# Altium project BaseBoard.PrjPcb
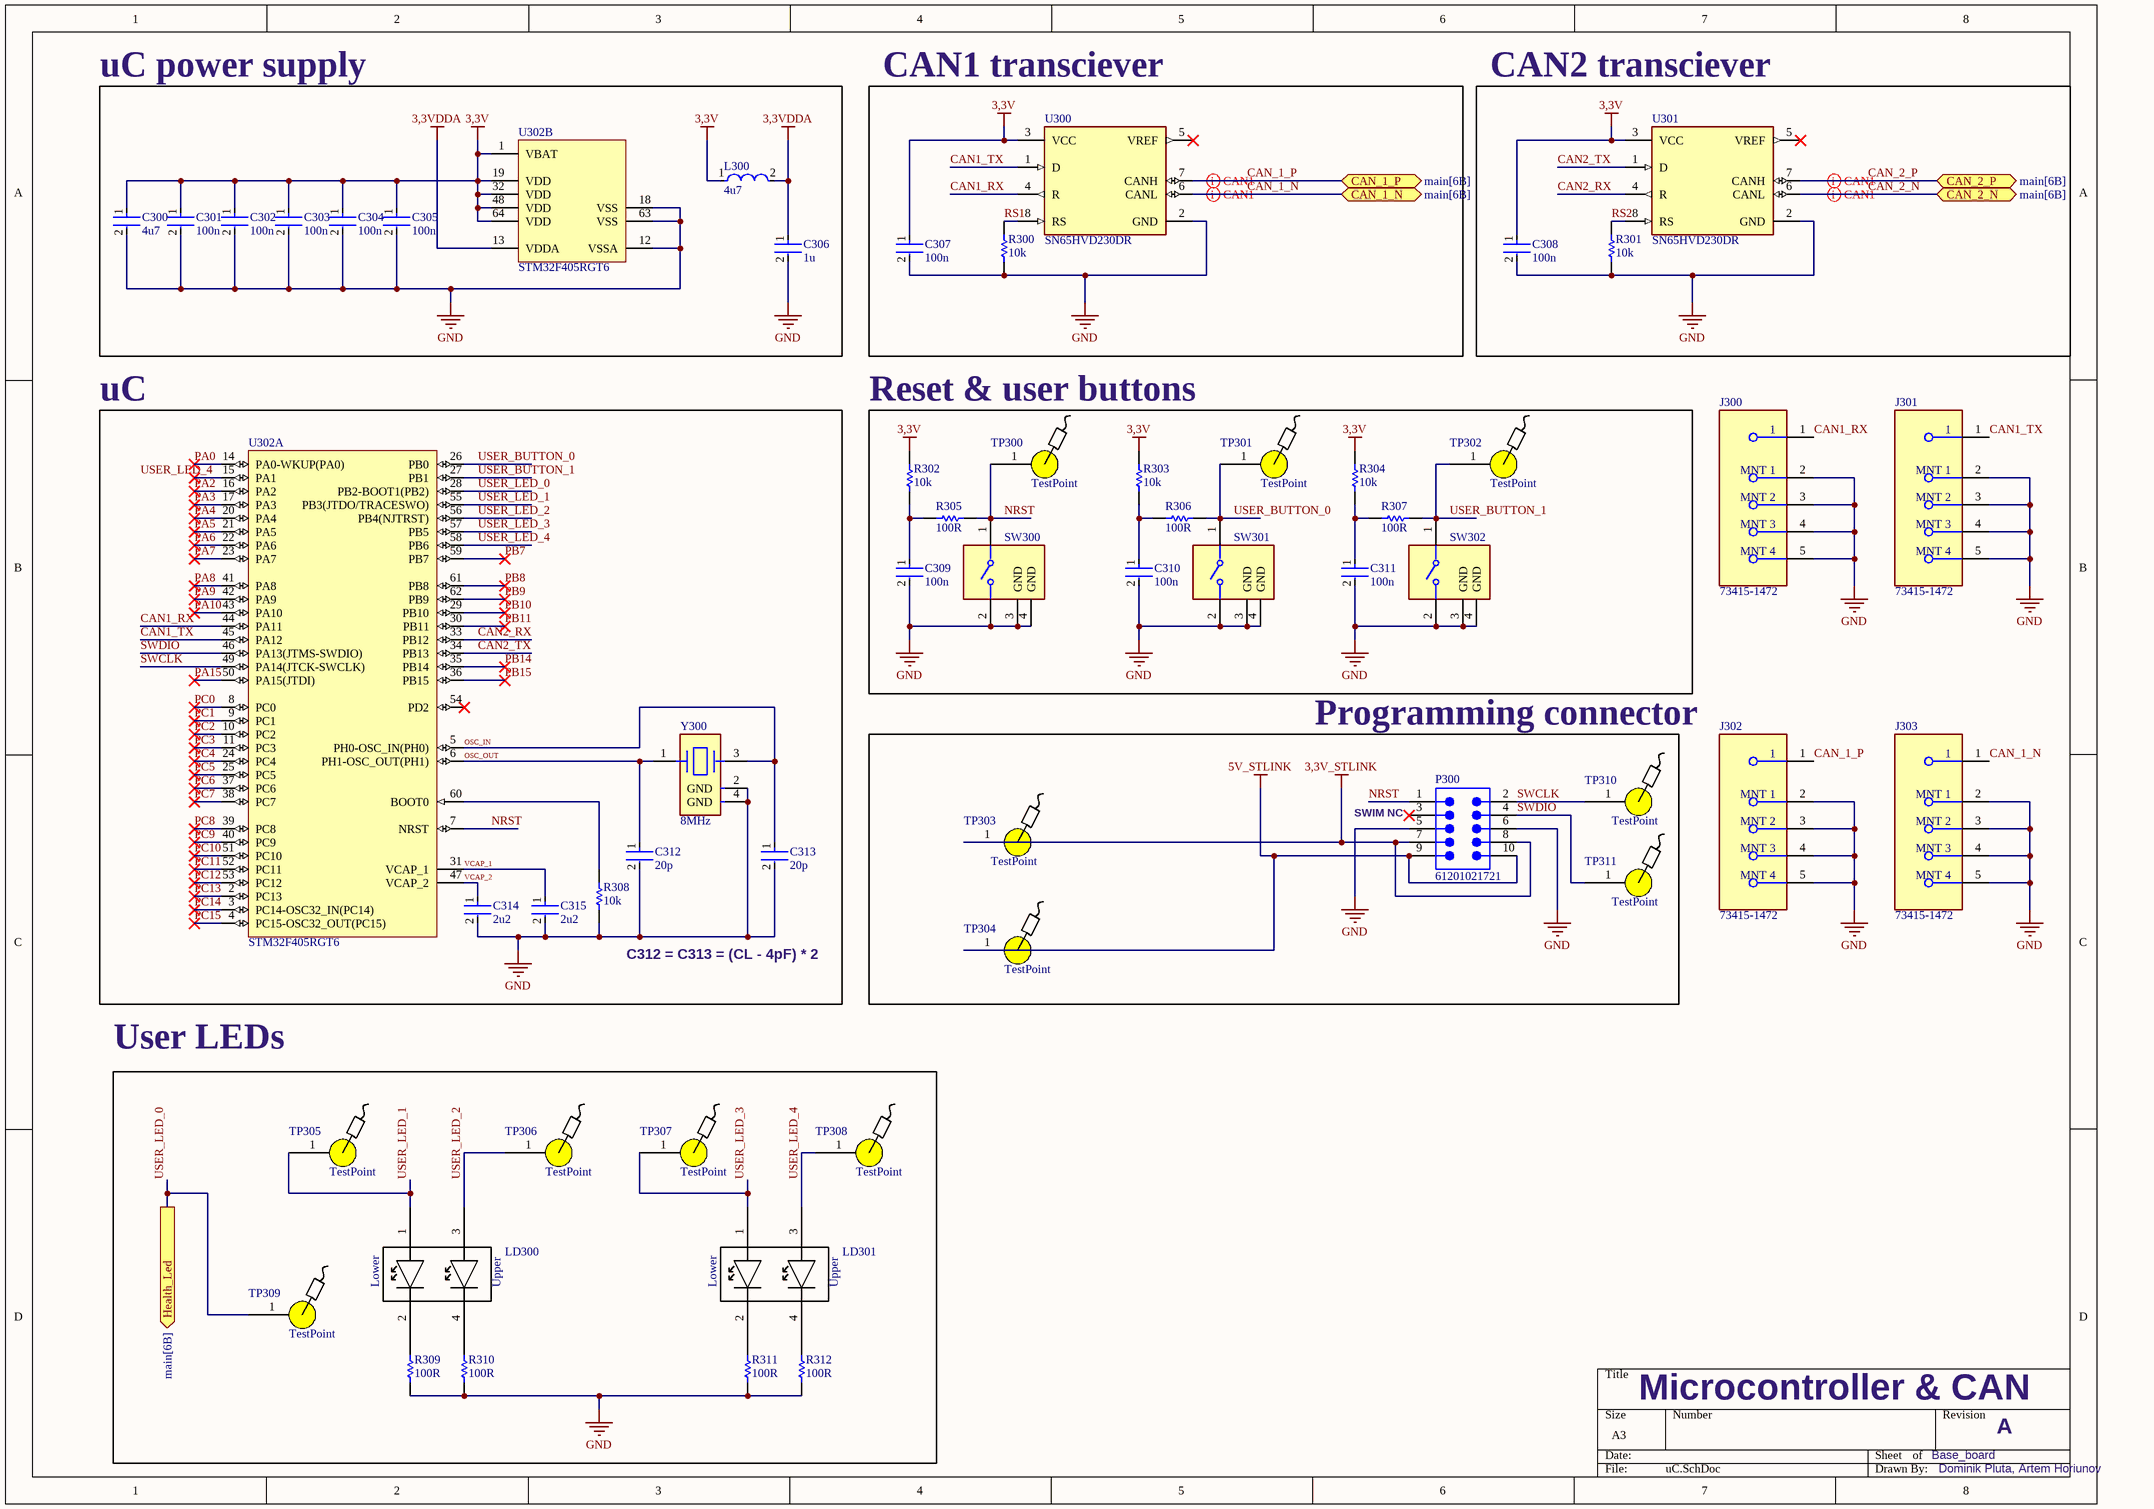
[diagram p0: uC.SchDoc]
2 sheets, 100 parts. Net scope: flat (ports and power ports of the same name join across sheets).
Board files: BaseBoard.PcbDoc, Buck3v3.PcbDoc, Buck5v.PcbDoc
Sheets:
  uC.SchDoc
  power.SchDoc

## Sheet uC.SchDoc
size A3; SheetNumber: 2; SheetTotal: 3

### Parts
C300  4u7  [FP-C0603C-CF-MFG]
C301  100n  [FP-C0603C-CF-MFG]
C302  100n  [FP-C0603C-CF-MFG]
C303  100n  [FP-C0603C-CF-MFG]
C304  100n  [FP-C0603C-CF-MFG]
C305  100n  [FP-C0603C-CF-MFG]
C306  1u  [FP-C0603C-CF-MFG]
C307  100n  [FP-C0603C-CF-MFG]
C308  100n  [FP-C0603C-CF-MFG]
C309  100n  [FP-C0603C-CF-MFG]
C310  100n  [FP-C0603C-CF-MFG]
C311  100n  [FP-C0603C-CF-MFG]
C312  20p  [FP-C0603C-CF-MFG]
C313  20p  [FP-C0603C-CF-MFG]
C314  2u2  [FP-C0603C-CF-MFG]
C315  2u2  [FP-C0603C-CF-MFG]
J300  73415-1472  [FP-73415-1472-MFG]
J301  73415-1472  [FP-73415-1472-MFG]
J302  73415-1472  [FP-73415-1472-MFG]
J303  73415-1472  [FP-73415-1472-MFG]
L300  4u7  [FP-LQM21DN_00-MFG]
LD300  (no value)  [LED_HOLDER]
LD301  (no value)  [LED_HOLDER]
P300  61201021721  [61201021721]
R300  10k  [RESC0603(1608)_N]
R301  10k  [RESC0603(1608)_N]
R302  10k  [RESC0603(1608)_N]
R303  10k  [RESC0603(1608)_N]
R304  10k  [RESC0603(1608)_N]
R305  100R  [RESC0603(1608)_N]
R306  100R  [RESC0603(1608)_N]
R307  100R  [RESC0603(1608)_N]
R308  10k  [RESC0603(1608)_N]
R309  100R  [RESC0603(1608)_N]
R310  100R  [RESC0603(1608)_N]
R311  100R  [RESC0603(1608)_N]
R312  100R  [RESC0603(1608)_N]
SW300  B3F-3122  [FP-B3F-3122-MFG]  (value not drawn)
SW301  B3F-3122  [FP-B3F-3122-MFG]  (value not drawn)
SW302  B3F-3122  [FP-B3F-3122-MFG]  (value not drawn)
TP300  TestPoint  [TestPoint]
TP301  TestPoint  [TestPoint]
TP302  TestPoint  [TestPoint]
TP303  TestPoint  [TestPoint]
TP304  TestPoint  [TestPoint]
TP305  TestPoint  [TestPoint]
TP306  TestPoint  [TestPoint]
TP307  TestPoint  [TestPoint]
TP308  TestPoint  [TestPoint]
TP309  TestPoint  [TestPoint]
TP310  TestPoint  [TestPoint]
TP311  TestPoint  [TestPoint]
U300  SN65HVD230DR  [FP-D0008A-IPC_A]
U301  SN65HVD230DR  [FP-D0008A-IPC_A]
U302  STM32F405RGT6  [STM-LQFP64_M]  (parts A,B of 2)
Y300  8MHz  [FP-7M-MFG]

### Blocks framed on the sheet
uC power supply: C300-C306 L300 U302
CAN1 transciever: C307 R300 U300
CAN2 transciever: C308 R301 U301
uC: C312-C315 R308 U302 Y300
Reset & user buttons: C309-C311 R302-R307 SW300-SW302 TP300-TP302
Programming connector: P300 TP303 TP304 TP310 TP311
User LEDs: LD300 LD301 R309-R312 TP305-TP309

### Ports
CAN_1_N (bidir, see main[6B]), CAN_1_P (bidir, see main[6B]), CAN_2_N (bidir, see main[6B]), CAN_2_P (bidir, see main[6B]), Health_Led (out, see main[6B])

### Nets
3,3V: C300.1 C301.1 C302.1 C303.1 C304.1 C305.1 C307.1 C308.1 L300.1 R302.2 R303.2 R304.2 U300.3(VCC) U301.3(VCC) U302.1(VBAT) U302.19(VDD) U302.32(VDD) U302.48(VDD) U302.64(VDD)
3,3V_STLINK: P300.7 P300.8 TP303.1
3,3VDDA: C306.1 L300.2 U302.13(VDDA)
5V_STLINK: P300.9 P300.10 TP304.1
GND: C300.2 C301.2 C302.2 C303.2 C304.2 C305.2 C306.2 C307.2 C308.2 C309.2 C310.2 C311.2 C312.2 C313.2 C314.2 C315.2 J300.2(MNT_1) J300.3(MNT_2) J300.4(MNT_3) J300.5(MNT_4) J301.2(MNT_1) J301.3(MNT_2) J301.4(MNT_3) J301.5(MNT_4) J302.2(MNT_1) J302.3(MNT_2) J302.4(MNT_3) J302.5(MNT_4) J303.2(MNT_1) J303.3(MNT_2) J303.4(MNT_3) J303.5(MNT_4) P300.5 P300.6 R300.1 R301.1 R308.1 R309.1 R310.1 R311.1 R312.1 SW300.2 SW300.3(GND) SW300.4(GND) SW301.2 SW301.3(GND) SW301.4(GND) SW302.2 SW302.3(GND) SW302.4(GND) U300.2(GND) U301.2(GND) U302.12(VSSA) U302.18(VSS) U302.63(VSS) Y300.2(GND) Y300.4(GND)
CAN1_RX: J300.1 U300.4(R) U302.44(PA11)
CAN1_TX: J301.1 U300.1(D) U302.45(PA12)
CAN2_RX: U301.4(R) U302.33(PB12)
CAN2_TX: U301.1(D) U302.34(PB13)
CAN_1_N: J303.1 U300.6(CANL) ; port CAN_1_N
CAN_1_P: J302.1 U300.7(CANH) ; port CAN_1_P
CAN_2_N: U301.6(CANL) ; port CAN_2_N
CAN_2_P: U301.7(CANH) ; port CAN_2_P
NRST: P300.1 R305.1 SW300.1 TP300.1 U302.7(NRST)
OSC_IN: C313.1 U302.5(PH0-OSC_IN(PH0)) Y300.3
OSC_OUT: C312.1 U302.6(PH1-OSC_OUT(PH1)) Y300.1
PA0: U302.14(PA0-WKUP(PA0))
PA2: U302.16(PA2)
PA3: U302.17(PA3)
PA4: U302.20(PA4)
PA5: U302.21(PA5)
PA6: U302.22(PA6)
PA7: U302.23(PA7)
PA8: U302.41(PA8)
PA9: U302.42(PA9)
PA10: U302.43(PA10)
PA15: U302.50(PA15(JTDI))
PB7: U302.59(PB7)
PB8: U302.61(PB8)
PB9: U302.62(PB9)
PB10: U302.29(PB10)
PB11: U302.30(PB11)
PB14: U302.35(PB14)
PB15: U302.36(PB15)
PC0: U302.8(PC0)
PC1: U302.9(PC1)
PC2: U302.10(PC2)
PC3: U302.11(PC3)
PC4: U302.24(PC4)
PC5: U302.25(PC5)
PC6: U302.37(PC6)
PC7: U302.38(PC7)
PC8: U302.39(PC8)
PC9: U302.40(PC9)
PC10: U302.51(PC10)
PC11: U302.52(PC11)
PC12: U302.53(PC12)
PC13: U302.2(PC13)
PC14: U302.3(PC14-OSC32_IN(PC14))
PC15: U302.4(PC15-OSC32_OUT(PC15))
RS1: R300.2 U300.8(RS)
RS2: R301.2 U301.8(RS)
SWCLK: P300.2 TP310.1 U302.49(PA14(JTCK-SWCLK))
SWDIO: P300.4 TP311.1 U302.46(PA13(JTMS-SWDIO))
USER_BUTTON_0: R306.1 SW301.1 TP301.1 U302.26(PB0)
USER_BUTTON_1: R307.1 SW302.1 TP302.1 U302.27(PB1)
USER_LED_0: TP309.1 U302.28(PB2-BOOT1(PB2)) ; port Health_Led
USER_LED_1: LD300.1 TP305.1 U302.55(PB3(JTDO/TRACESWO))
USER_LED_2: LD300.3 TP306.1 U302.56(PB4(NJTRST))
USER_LED_3: LD301.1 TP307.1 U302.57(PB5)
USER_LED_4: LD301.3 TP308.1 U302.58(PB6)
VCAP_1: C315.1 U302.31(VCAP_1)
VCAP_2: C314.1 U302.47(VCAP_2)
NetC309_1: C309.1 R302.1 R305.2
NetC310_1: C310.1 R303.1 R306.2
NetC311_1: C311.1 R304.1 R307.2
NetLD300_2: LD300.2 R309.2
NetLD300_4: LD300.4 R310.2
NetLD301_2: LD301.2 R311.2
NetLD301_4: LD301.4 R312.2
NetR308_2: R308.2 U302.60(BOOT0)

Not connected (* = marked no-connect by the designer): P300 3*; U300 5(VREF)*; U301 5(VREF)*; U302 15(PA1)* 54(PD2)*

### Layout directives
differential pair: CAN_1_N, CAN_1_P, CAN_2_N, CAN_2_P

### Notes on the sheet
- (near P300) SWIM NC
- (near R308) C312 = C313 = (CL - 4pF) * 2
- Microcontroller & CAN
- Base_board
- A
- Dominik Pluta, Artem Horiunov
- Labels drawn without touching a wire or pin: USER_LED_4
- (in symbol DoubleStack_Side_Led_3mm) Lower; Upper

### Library data of the parts
C300-C311 = CMP-2006-03061-2: CAP CER 0.1UF 50V X7R 0603; Manufacturer: KEMET; Manufacturer Part Number: C0603C104K5RACTU; Tolerance: 0.1; Temperature Coefficient: 30ppm/°C; Material: Ceramic; Automotive Grade: Grade 1; Value: 0.10 μF; Temperature: -55°C to +125°C; RoHS: TRUE; Temperature Range High: +125°C; Lead Free: Yes; Octopart: https://octopart.com/c0603c104k5ractu-kemet-139244; Digikey Description: CAP CER 0.1UF 50V X7R 0603; Category: Cap; Package: C0603C-CF; ComponentLink2Description: Datasheet; Temperature Range Low: -55°C; Device Class L1: Passive Components; Voltage Rating: 50 V; Automotive: Yes; Device Class L3: Ceramic Capacitors; ComponentLink2URL: https://api.kemet.com/component-edge/download/datasheet/C0603C100J5GACAUTO.pdf; Capacitance: 0.10 μF; Device Class L2: Capacitors; Temperature Characteristic: X7R; Height: 0.87mm
C312-C315 = CMP-2006-03061-2: CAP CER 50V X7R 0603; Manufacturer: KEMET; Manufacturer Part Number: C0603C104K5RACTU; Tolerance: 0.1; Temperature Coefficient: 30ppm/°C; Material: Ceramic; Automotive Grade: Grade 1; Value: 0.10 μF; Temperature: -55°C to +125°C; RoHS: TRUE; Temperature Range High: +125°C; Lead Free: Yes; Octopart: https://octopart.com/c0603c104k5ractu-kemet-139244; Digikey Description: CAP CER 0.1UF 50V X7R 0603; Category: Cap; Package: C0603C-CF; ComponentLink2Description: Datasheet; Temperature Range Low: -55°C; Device Class L1: Passive Components; Voltage Rating: 50 V; Automotive: Yes; Device Class L3: Ceramic Capacitors; ComponentLink2URL: https://api.kemet.com/component-edge/download/datasheet/C0603C100J5GACAUTO.pdf; Capacitance: 0.10 μF; Device Class L2: Capacitors; Temperature Characteristic: X7R; Height: 0.87mm
J300-J303 = CMP-00257-24916978-1: 73415-1472 50 Ohms, MMCX Vertical Jack, PCB, Brass and Gold Per Commercial Requirements, One Piece Per Bag; Manufacturer Lifecycle Status: ACTIVE; Dielectric Material: Teflon; Number of Contacts: 1; Resistance: 50Ω; Voltage Rating: 170V; Frequency: 6GHz; Orientation: Straight; Min Operating Temperature: -55°C; Height: 4.55mm; Max Operating Temperature: 165°C; Country of Origin: TW; Lifecycle Status: Production; Packaging: Bulk; Halogen Free: Low Halogen; NexarPartId: 24916978; RoHS: Non-Compliant; Contact Material: Gold; Impedance: 50Ω; Mount: Through Hole
L300 = CMP-06042-016438-1: Multilayer Type Inductor for General Circuits, 0805 (2012), 0.22μH, 10%, 0.38Ω, 250mA; Shielding: Shielded; Self Resonant Frequency: 220MHz; Q Factor: 20; DC Resistance (DCR): 380mR; Inductance: 220nH; Core Material: Ferrite; Test Frequency: 25MHz; Min Operating Temperature: -40°C; RoHS Compliant: Yes; Inductance Tolerance: 10%; Width: 1.25mm; Current Rating: 250mA; Rated Current-Max: 250mA; Package Quantity: 4000; Lead Free: Lead Free; Termination: SMD/SMT; Military Standard: Not; Case Code (Metric): 2012; Radiation Hardening: No; Max Operating Temperature: 85°C; Max DC Current: 250mA; Mount: Surface Mount; Length: 2mm; Packaging: Tape and Reel; Height - Seated (Max): 0.041inch; Series: LQM21N; Case Code (Imperial): 0805; Case/Package: 0805; REACH SVHC: No SVHC; Depth: 1.45mm; Tolerance: 10%; DC Current: 250mA; Number of Pins: 2; Height: 0.85mm
LD300 LD301 = DoubleStack_Side_Led_3mm
P300 = CMP-1502-00021-2: NexarPartId: 8917787; Operating Supply Voltage: 250V; Number of Positions: 10; Contact Resistance: 20mΩ; Connector Type: Male Pin; Current Rating: 3A; Pitch: 2.54mm; Gender: Male; Insulation Resistance: 1GΩ; Insulation: Insulated; Max Operating Temperature: 105°C; Flammability Rating: UL94 V-0; Mount: Through Hole; Contact Material: Copper; Min Operating Temperature: -40°C; Length: 20.36mm; Number of Contacts: 10; Height: 8.85mm; Number of Rows: 2; Housing Material: PBT; Color: Black; Contact Gender: Male; Orientation: Right Angle; Contact Plating: Gold; Number of Pins: 10; Voltage Rating (DC): 250V; RoHS: Compliant; Insulation Material: PBT; REACH SVHC: Unknown; Row Spacing: 2.54mm; Voltage Rating: 250V; Width: 20.36mm; Lead Pitch: 2.54mm; Termination: Through Hole
R300 R301 R308 = CMP-1012-00081-1: 2K 0.1W 5% 0603 (1608 Metric)  SMD; Case-Metric: 1608; Value: 2000.00 Ohm; Case-EIA: 0603; Tolerance: 5 %; Technology: SMT; Power: 0.1 W
R302-R307 = CMP-1012-00081-1: 0.1W 5% 0603 (1608 Metric)  SMD; Case-Metric: 1608; Value: 2000.00 Ohm; Case-EIA: 0603; Tolerance: 5 %; Technology: SMT; Power: 0.1 W
R309-R312 = CMP-1012-00081-1: 0.1W 1% 0603 (1608 Metric)  SMD; Tolerance: 5 %; Case-Metric: 1608; Value: 2000.00 Ohm; Case-EIA: 0603; Technology: SMT; Power: 0.1 W
SW300-SW302 = CMP-08834-000053-1: SWITCH TACTILE SPST-NO 0.05A 24V; Max Current Rating: 50mA; Actuator Type: Standard; Ratings: IP00; Number of Poles: 1; Mechanical Life: 300000Cycles; Illumination Type: Non-Illuminated; Switch Function: Off-Mom; Actuator Color: Grey; Contact Resistance: 100mR; Throw Configuration: SPST; Actuator Length: 1.6mm; Switch Travel: 0.25mm; Operating Force: 1.47N; Weight: 0.25g; Voltage Rating (DC): 24V; Contact Plating: Gold; RoHS Compliant: Yes; Contact Material: Gold; Radiation Hardening: No; Packaging: Bulk; Height: 7.4mm; Min Operating Temperature: -25°C; Electrical Life: 300000Cycles; Depth: 7.85mm; Max Voltage Rating (DC): 24V; Mount: Through Hole; Width: 6.25mm; Current Rating: 50mA; Lead Free: Lead Free; Max Operating Temperature: 70°C; Series: B3F; Contact Current Rating: 50mA; Package Quantity: 1000; Termination: PC Pins; Orientation: Right Angle; Length: 7.3mm
U300 U301 = CMP-0315-00015-3: IC TRANSCEIVER HALF 1/1 8SOIC; Number of Transceivers: 1; Operating Supply Voltage: 3.3V; Number of I/Os: 2; Max Supply Current: 17mA; Max Supply Voltage: 3.6V; Min Supply Voltage: 3V; Data Rate: 1Mbps; Min Operating Temperature: -40°C; Packaging: Tape and Reel; Lead Free: Lead Free; Number of Transmit Buffers: 1; Max Operating Temperature: 85°C; Number of Receive Buffers: 1; Number of Pins: 8; Package Quantity: 1; Radiation Hardening: No; Case/Package: D; REACH SVHC: No SVHC; Weight: 0.002561oz; Termination: SMD/SMT; Contact Plating: Gold; Nominal Supply Current: 17mA; Number of Receivers: 1; Number of Drivers: 1
U302 = CMP-0243-00019-3: ARM Cortex-M4 32-bit MCU+FPU, 210 DMIPS, 1024 kB Flash, 192 kB Internal RAM, 51 I/Os, 64-pin LQFP, -40 to 85 degC, Tray; Manufacturer: STMicroelectronics; Supply Voltage(Vcc) min (V): 1.8; Supply Voltage(Vcc) max (V): 3.6; Internal RAM Size (kB): 192; I/Os (High Current): 51; D/A Converter: 2x12-bit; FLASH Size (Prog) (kB): 1024; Operating Frequency(F) (Processor speed) (MHz): 168; ComponentLink2Description: Datasheet; PackageVersion: Rev. 4, 06/2013; DatasheetVersion: Rev. 4; Core: ARM Cortex-M4; ComponentLink2URL: http://www.st.com/st-web-ui/static/active/en/resource/technical/document/datasheet/DM00037051.pdf; PackageReference: LQFP64; Packing: Tray; ComponentLink1Description: Manufacturer URL; ComponentLink3URL: http://www.st.com/st-web-ui/static/active/en/resource/technical/document/datasheet/DM00037051.pdf; ComponentLink3Description: Package Specification; Mounting Technology: Surface Mount; ComponentLink1URL: http://www.st.com/web/en/home.html; PackageDescription: 64-Pin Low Profile Quad Flat Package, 10 x 10 mm Body, 0.5 mm Pitch; PartNumber: STM32F405RGT6
Y300 = CMP-18717-000311-1: Crystal; ESR (Equivalent Series Resistance): 100R; Frequency: 12MHz; Frequency Stability: 10ppm; Load Capacitance: 10pF; Width: 0.098inch; Number of Pins: 4; Case/Package: SMD/SMT; REACH SVHC: No SVHC; Mount: Surface Mount; Max Operating Temperature: 70°C; RoHS Compliant: Yes; Depth: 2.5mm; Length: 3.2mm; Termination: SMD/SMT; Frequency Tolerance: 10ppm; Min Operating Temperature: -20°C; Series: 7M; Packaging: Tape and Reel; Tolerance: 10ppm; Height: 0.031inch; Package Quantity: 3000

## Sheet power.SchDoc
size A3; SheetNumber: 3; SheetTotal: 3
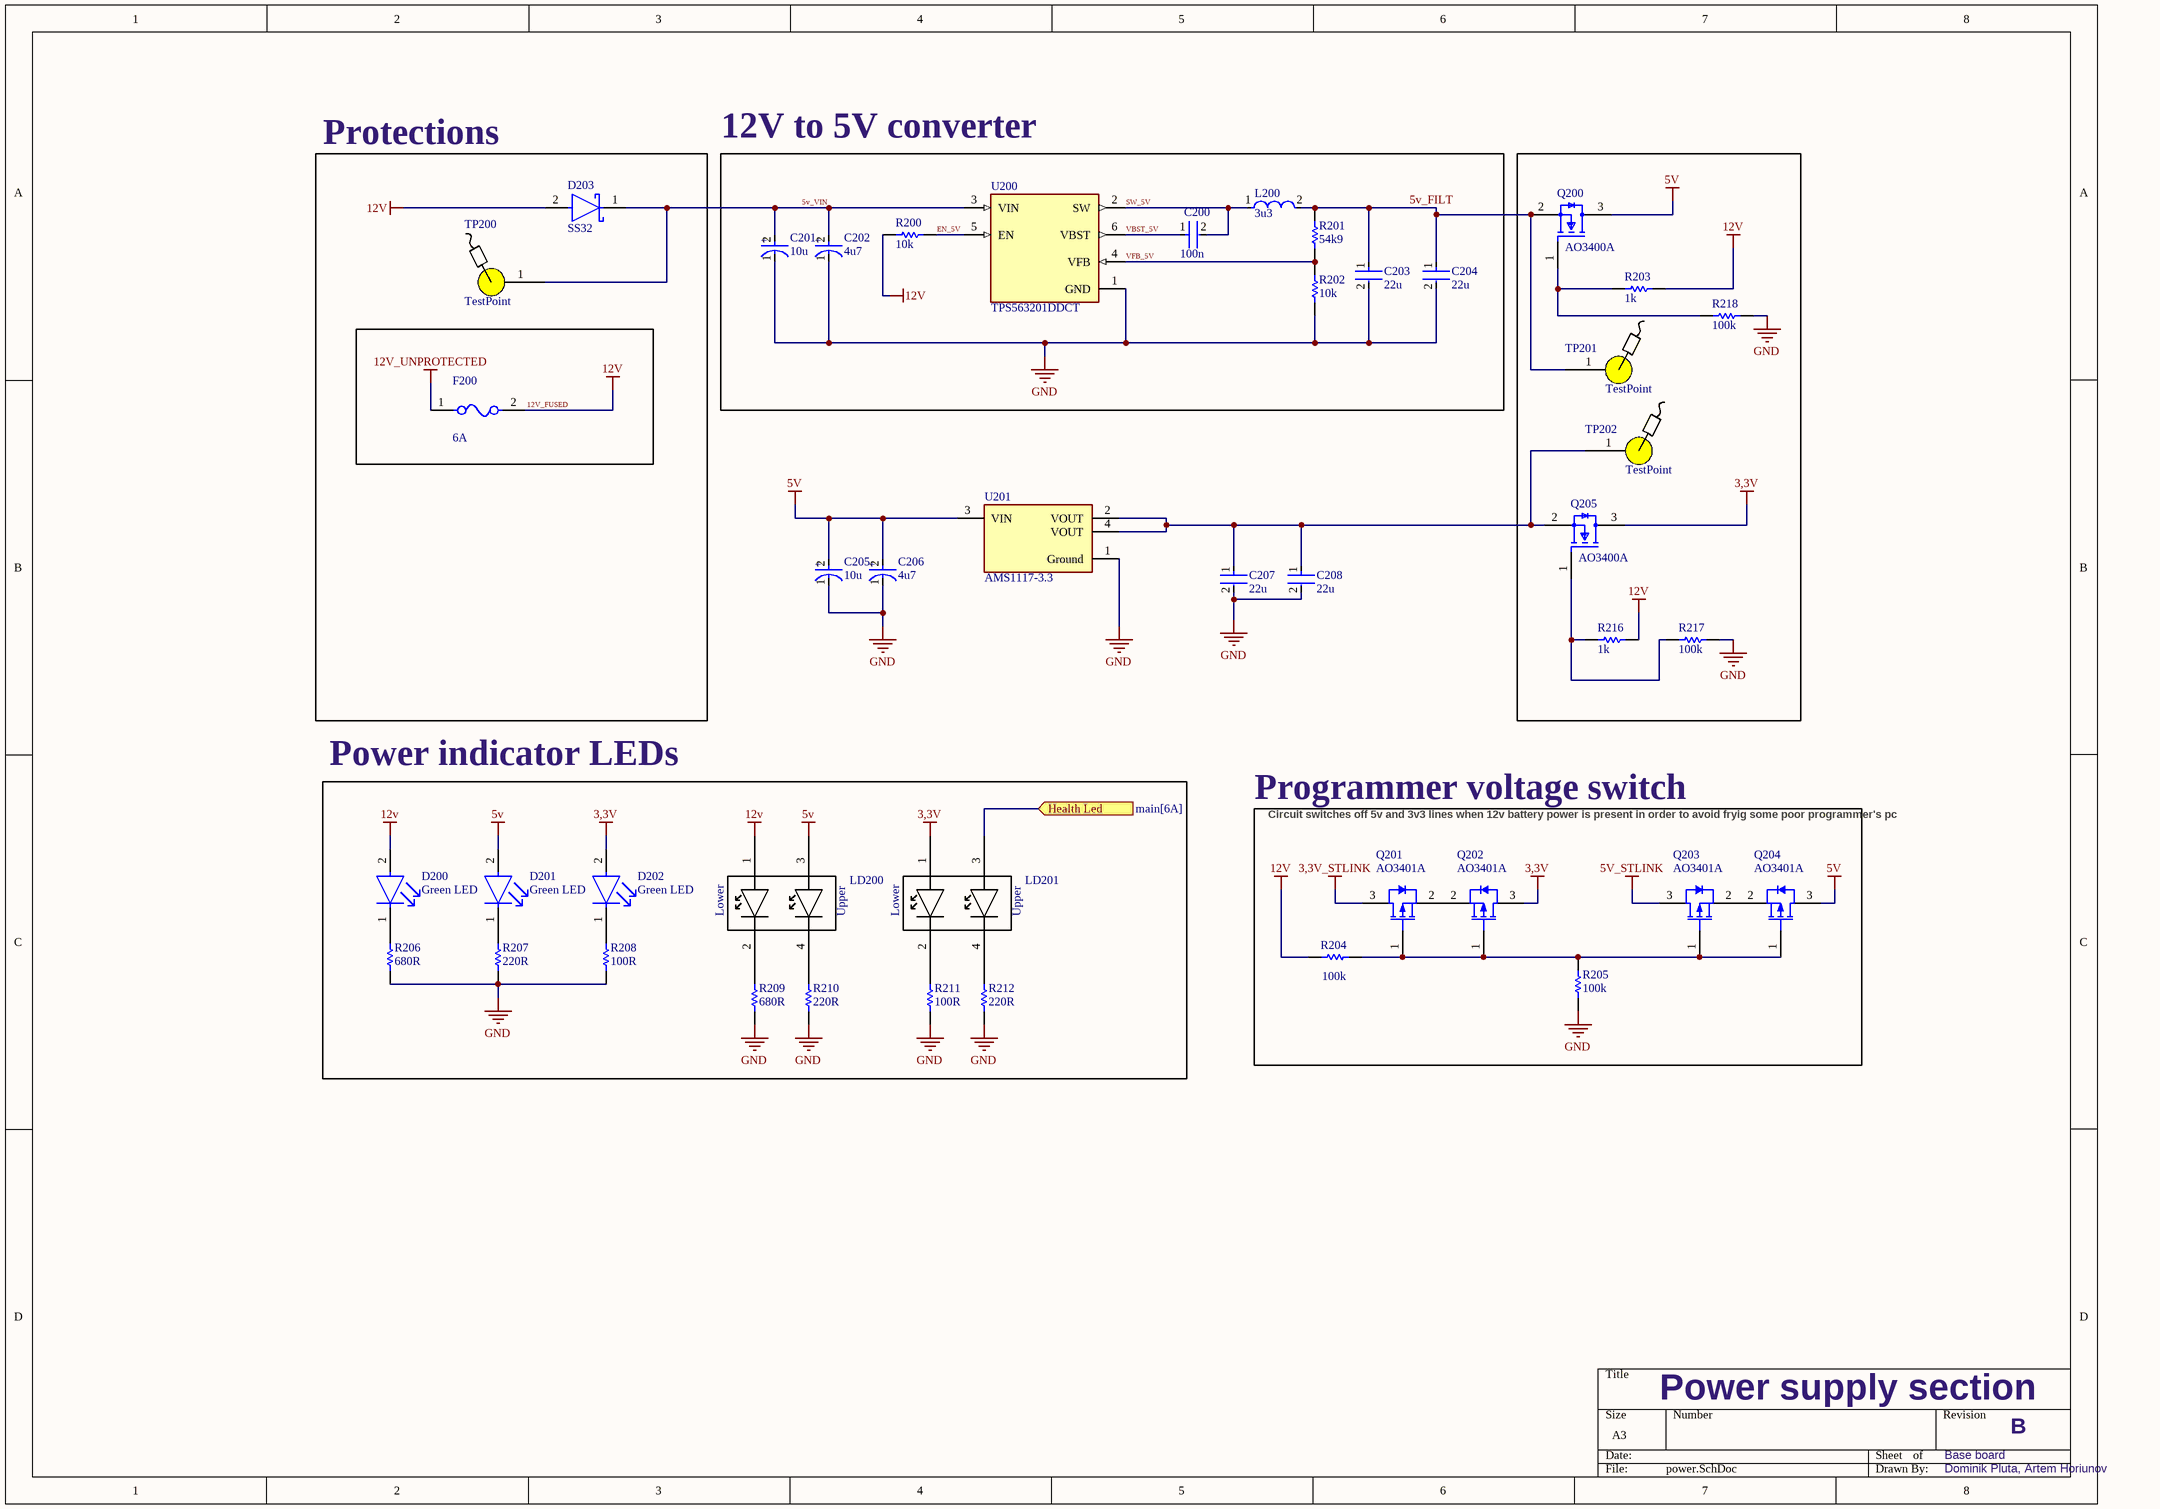
[diagram p1: power.SchDoc]

### Parts
C200  100n  [FP-C0603C-CF-MFG]
C201  10u  [FP-POSCAP-B2-MFG]
C202  4u7  [FP-POSCAP-B2-MFG]
C203  22u  [FP-C3216-085-0_2-MFG]
C204  22u  [FP-C3216-085-0_2-MFG]
C205  10u  [FP-POSCAP-B2-MFG]
C206  4u7  [FP-POSCAP-B2-MFG]
C207  22u  [FP-C3216-085-0_2-MFG]
C208  22u  [FP-C3216-085-0_2-MFG]
D200  Green LED  [FP-HSME-C191-MFG]
D201  Green LED  [FP-HSME-C191-MFG]
D202  Green LED  [FP-HSME-C191-MFG]
D203  SS32  [FP-403AG-MFG]
F200  6A  [FP-0466-MFG]
L200  3u3  [FP-SRP4020TA-MFG]
LD200  (no value)  [LED_HOLDER]
LD201  (no value)  [LED_HOLDER]
Q200  AO3400A  [FP-SOT23-MFG]
Q201  AO3401A  [AO-SOT-23-3L_V]
Q202  AO3401A  [AO-SOT-23-3L_V]
Q203  AO3401A  [AO-SOT-23-3L_V]
Q204  AO3401A  [AO-SOT-23-3L_V]
Q205  AO3400A  [FP-SOT23-MFG]
R200  10k  [RESC0603(1608)_N]
R201  54k9  [RESC0603(1608)_N]
R202  10k  [RESC0603(1608)_N]
R203  1k  [RESC0603(1608)_N]
R204  100k  [RESC0603(1608)_N]
R205  100k  [RESC0603(1608)_N]
R206  680R  [RESC0603(1608)_N]
R207  220R  [RESC0603(1608)_N]
R208  100R  [RESC0603(1608)_N]
R209  680R  [RESC0603(1608)_N]
R210  220R  [RESC0603(1608)_N]
R211  100R  [RESC0603(1608)_N]
R212  220R  [RESC0603(1608)_N]
R216  1k  [RESC0603(1608)_N]
R217  100k  [RESC0603(1608)_N]
R218  100k  [RESC0603(1608)_N]
TP200  TestPoint  [TestPoint]
TP201  TestPoint  [TestPoint]
TP202  TestPoint  [TestPoint]
U200  TPS563201DDCT  [SOT95P280X110-6N]
U201  AMS1117-3.3  [FP-AMS1117-IPC_C]

### Blocks framed on the sheet
Protections: D203 F200 TP200
12V to 5V converter: C200-C204 L200 R200-R202 U200
Power indicator LEDs: D200-D202 LD200 LD201 R206-R212
Programmer voltage switch: Q201-Q204 R204 R205

### Ports
Health Led (in, see main[6A])

### Nets
3,3V: D202.2(A) LD201.1 Q202.3(DRAIN) Q205.3(D)
3,3V_STLINK: Q201.3(DRAIN)
5V: C205.2(A) C206.2(A) D201.2(A) LD200.3 Q200.3(D) Q204.3(DRAIN) U201.3(VIN)
5V_STLINK: Q203.3(DRAIN)
12V_FUSED: D200.2(A) D203.2(A) F200.2 LD200.1 R200.2 R203.1 R204.1 R216.1  [also labelled 12v]
12V_UNPROTECTED: F200.1
GND: C201.1(C) C202.1(C) C203.2 C204.2 C205.1(C) C206.1(C) C207.2 C208.2 R202.1 R205.2 R206.1 R207.1 R208.1 R209.1 R210.1 R211.1 R212.1 R217.2 R218.2 U200.1(GND) U201.1(Ground)
5v_FILT: C203.1 C204.1 L200.2 Q200.2(S) R201.2 TP201.1
5v_VIN: C201.2(A) C202.2(A) D203.1(C) TP200.1 U200.3(VIN)
EN_5V: R200.1 U200.5(EN)
SW_5V: C200.2 L200.1 U200.2(SW)
VBST_5V: C200.1 U200.6(VBST)
VFB_5V: R201.1 R202.2 U200.4(VFB)
NetC207_1: C207.1 C208.1 Q205.2(S) TP202.1 U201.2(VOUT) U201.4(VOUT)
NetD200_1: D200.1(C) R206.2
NetD201_1: D201.1(C) R207.2
NetD202_1: D202.1(C) R208.2
NetLD200_2: LD200.2 R209.2
NetLD200_4: LD200.4 R210.2
NetLD201_2: LD201.2 R211.2
NetLD201_3: LD201.3 ; port Health Led
NetLD201_4: LD201.4 R212.2
NetQ200_1: Q200.1(G) R203.2 R218.1
NetQ201_1: Q201.1(GATE) Q202.1(GATE) Q203.1(GATE) Q204.1(GATE) R204.2 R205.1
NetQ201_2: Q201.2(SOURCE) Q202.2(SOURCE)
NetQ203_2: Q203.2(SOURCE) Q204.2(SOURCE)
NetQ205_1: Q205.1(G) R216.2 R217.1

### Notes on the sheet
- Circuit switches off 5v and 3v3 lines when 12v battery power is present in order to avoid fryig some poor programmer's pc
- Power supply section
- Base board
- B
- Dominik Pluta, Artem Horiunov
- (in symbol CMP-05428-001070-1) +
- (in symbol DoubleStack_Side_Led_3mm) Lower; Upper

### Library data of the parts
C200 = CMP-2006-03061-2: as C300 on sheet uC; Temperature: -55°C to +125°C; RoHS: TRUE; Temperature Range High: +125°C; Lead Free: Yes; Octopart: https://octopart.com/c0603c104k5ractu-kemet-139244; Digikey Description: CAP CER 0.1UF 50V X7R 0603; Category: Cap; Package: C0603C-CF; ComponentLink2Description: Datasheet; Temperature Range Low: -55°C; Device Class L1: Passive Components; Voltage Rating: 50 V; Automotive: Yes; Device Class L3: Ceramic Capacitors; ComponentLink2URL: https://api.kemet.com/component-edge/download/datasheet/C0603C100J5GACAUTO.pdf; Capacitance: 0.10 μF; Device Class L2: Capacitors; Temperature Characteristic: X7R; Height: 0.87mm
C201 C202 C205 C206 = CMP-05428-001070-1: Molded Tantalum Polymer Capacitor 10uF 20% 16V life 2000Hours SMD 1411; Leakage Current: 48uA; ESR (Equivalent Series Resistance): 100mR; Ripple Current: 800mA; Dissipation Factor: 10%; Polarity: Polar; Voltage Rating: 16V; REACH SVHC: No SVHC; Width: 2.8mm; Construction: Flat; Features: General Purpose; Life (Hours): 2000Hour; Radiation Hardening: No; Length: 3.5mm; Termination: SMD/SMT; Series: POSCAP™ TQC; Voltage Rating (DC): 16V; Mount: Surface Mount; Min Operating Temperature: -55°C; Lead Free: Lead Free; Tolerance: 20%; Number of Pins: 2; Case/Package: 1411; Case Code (Metric): 3528; Height: 1.9mm; Height - Seated (Max): 0.083inch; Package Quantity: 2000; Capacitance: 10uF; RoHS Compliant: Yes; Case Code (Imperial): 1210; Packaging: Tape and Reel; Voltage: 16V; Max Operating Temperature: 105°C; Depth: 2.8mm
C203 C204 C207 C208 = CMP-08246-004858-1: Multilayer Ceramic Capacitors 22μF ±20% 6.3V X5R SMD 1206; Capacitance: 22uF; RoHS Compliant: Yes; Case/Package: 1206; Length: 0.126inch; Thickness: 0.037inch; Min Operating Temperature: -55°C; REACH SVHC: No SVHC; Number of Pins: 2; Weight: 0.000571oz; Resistor Type: Ceramic; Dielectric: X5R; Tolerance: 20%; Max Operating Temperature: 85°C; Package Quantity: 1; Series: C; Depth: 1.6mm; Width: 0.063inch; Lead Free: Lead Free; Dielectric Material: Ceramic; Case Code (Imperial): 1206; Mount: Surface Mount; Voltage Rating: 6.3V; Voltage Rating (DC): 6.3V; Case Code (Metric): 3216; Height: 0.85mm; Packaging: Cut Tape; Termination: SMD/SMT
D200-D202 = CMP-18399-000013-1: LED GREEN DIFFUSED 0603 SMD; Manufacturer: Broadcom; Manufacturer Part Number: HSME-C191; Forward Current: 20mA; Reverse Voltage: 5V; Forward Voltage: 2.1V; Viewing Angle: 170°; Wavelength: 572nm; Power Dissipation: 52mW; Max Junction Temp: +95°C; Luminous Intensity: 50mcd; Led Orientation: Top View; Peak Emmision Wavelength: 570nm; Package: 0; Category: Diode; ComponentLink2URL: https://docs.broadcom.com/docs/AV02-0976EN; ComponentLink2Description: Datasheet; Device Class L2: LEDs; Digikey Description: LED GREEN DIFFUSED 0603 SMD; Height: 0.7mm; RoHS: TRUE; Colour: Green; Lead Free: Yes; Device Class L1: Optoelectronics; Device Class L3: unset; Temperature Range High: +85°C; Automotive: No; Temperature: -40°C to +85°C; Octopart: https://octopart.com/hsme-c191-broadcom-71131261; Mouser Description: Standard LEDs - SMD AlInGaP Green; Temperature Range Low: -40°C
D203 = CMP-00278-84331622-1: SS32 Rectifier Diode, Schottky, 1 Phase, 1 Element, 3A, 20V V(RRM), Silicon, DO-214AB; Manufacturer Lifecycle Status: ACTIVE; Forward Voltage: 500mV; Max Forward Surge Current (Ifsm): 100A; Max Reverse Leakage Current: 500µA; Max Junction Temperature (Tj): 150°C; Element Configuration: Single; Max Power Dissipation: 2.27W; Polarity: Standard; Number of Elements: 1; RoHS: Compliant; Forward Current: 3A; Height: 2.65mm; Max Reverse Voltage (DC): 20V; NexarPartId: 84331622; Max Repetitive Reverse Voltage (Vrrm): 20V; Schedule B: 8541100080, 8541100080; Lead Free: Lead Free; Current Rating: 3A; Radiation Hardening: No; Mount: Surface Mount; Max Operating Temperature: 150°C; Average Rectified Current: 3A; Number of Pins: 2; Output Current: 3A; Packaging: Cut Tape; Min Operating Temperature: -55°C; Max Surge Current: 100A; REACH SVHC: No SVHC; Case/Package: SMC; Weight: 300mg; Lifecycle Status: Production; Peak Reverse Current: 500µA; Number of Terminals: 2; Width: 6.25mm; Length: 7.15mm; Voltage Rating (DC): 20V; Peak Non-Repetitive Surge Current: 100A
F200 = CMP-08605-000093-1: Voltage Rating: 63V; Body Material: Thermoplastic; Fuse Type: Board Mount (Cartridge Style Excluded); Resistance: 220mR; Current Rating: 750mA; DC Cold Resistance: 111mR; Approvals: UL; Package Quantity: 5000; Radiation Hardening: No; Width: 0.06inch; Mount: Surface Mount; Case Code (Metric): 3216; Length: 3.18mm; Depth: 1.52mm; Series: 466; Voltage Rating (AC): 63V; Case Code (Imperial): 1206; Voltage Rating (DC): 63V; Min Operating Temperature: -55°C; Height: 0.023inch; Working Voltage: 63V; RoHS Compliant: Yes; Packaging: Tape and Reel; Number of Pins: 2; Lead Free: Lead Free; Case/Package: 1206; Max Operating Temperature: 90°C; Termination: SMD/SMT; Fuse Current: 750mA
L200 = CMP-07248-000008-1: MDA4020-3R3M / 3.3uH ±20% 3.1A 65mΩ SMD,4.1x4.5mm Inductors (SMD) ROHS; Manufacturer: Bourns; Manufacturer Part Number: SRP4020TA-3R3M; Shielding: true; Test Frequency: 100kHz; Self Resonant Frequency: 40MHz; Saturation Current: 4A; Q Factor: 10; Series Resistance: 76mΩ; Automotive Grade: Grade 0; Core Material: Carbonyl Powder; Rms Current: 3.5A; Temperature Range High: +150°C; Height: 2.1mm; Temperature: -40°C to +150°C; RoHS: TRUE; Device Class L3: Fixed Inductors; Automotive: Yes; Octopart: https://octopart.com/srp4020ta-3r3m-bourns-47300338; Composition: Wirewound; Mouser Description: Ind Power Shielded Wirewound 3.3uH 20% 100KHz Carbonyl Powder 3.5A T/R; Category: Ind; ComponentLink2Description: Datasheet; ComponentLink2URL: https://www.bourns.com/docs/Product-Datasheets/SRP4020TA.pdf; Digikey Description: FIXED IND 3.3UH 3.5A 76 MOHM SMD; Lead Free: Yes; Temperature Range Low: -40°C; Inductance: 3.3uH; Tolerance: 20%; Package: SRP4020TA; Value: 3.3uH; Device Class L1: Passive Components; Device Class L2: Inductors
LD200 LD201 = DoubleStack_Side_Led_3mm
Q200 Q205 = CMP-83955-000006-1: MOSFET N-CH 30V 5.7A SOT23; Input Capacitance: 630pF; Number of Elements: 1; Rds On Max: 26.5mR; Max Power Dissipation: 1.4W; Gate to Source Voltage (Vgs): 12V; Min Operating Temperature: -55°C; Lead Free: Lead Free; Number of Pins: 3; Drain to Source Voltage (Vdss): 30V; Case/Package: SOT-23; Mount: Surface Mount; Continuous Drain Current (ID): 5.7A; Radiation Hardening: No; Packaging: Tape and Reel; Max Operating Temperature: 150°C; Power Dissipation: 1.4W
Q201-Q204 = CMP-2000-05778-1: P-Channel MOSFET, 30 V, 4 A, -55 to 150 degC, 3-Pin SOT-23-3L, RoHS, Tape and Reel; Manufacturer: Alpha and Omega; Output Power (Max): NotRequiredW; Power Dissipation: 1.4W; Rad Hardened: No; Drain Efficiency: NotRequired%; Drain-Source On-Volt: 30V; Noise Figure: NotRequireddB; Frequency (Max): NotRequiredMHz; Number of  Elements: 1; Gate-Source Voltage (Max): ?12V; Drain Current (Max): 4A; Channel Mode: Enhancement; Drain-Source On-Res: 0.044ohm; Type: PowerMOSFET; Polarity: P; Package URL: http://www.aosmd.com/res/packaging_information/SOT-23-3L.pdf; Datasheet URL: http://www.aosmd.com/res/data_sheets/AO3401A.pdf; Package Type: SOT-23; Package Description: 3-Pin Small Outline Transistor, Body 2.95 x 1.6 mm, Pitch 0.95 mm; Mounting: SurfaceMount; Manufacturer URL: http://www.aosmd.com/; Continuous Drain Current: 4A; Package Reference: SOT-23-3L; Mounting Technology: SurfaceMount; Operating Temperature Classification: Military; Power Gain: NotRequireddB; Datasheet Version: Rev. 3, 03/2011; Operating Temp Range: -55Cto150C; Pin Count: 3
R200 R202-R205 R216-R218 = CMP-1012-00081-1: as R300 on sheet uC; Tolerance: 5 %; Technology: SMT; Power: 0.1 W
R201 R206-R212 = CMP-1012-00081-1: as R309 on sheet uC; Technology: SMT; Power: 0.1 W
U200 = CMP-007-000000-1: Design Item ID: TPS563201DDCT; Component Type: Standard; Price: None; MP: TPS563201DDCT; Package: None; Source: TPS563201DDCT.SchLib; Value: *; Pin Count: 6; Availability: Unavailable
U201 = CMP-209535-000001-1: LDO Voltage Regulators 1A, 3.3V; Manufacturer: Advanced Monolithic Systems; Dropout Voltage: 1.1V; Output Type: Fixed; Nominal Supply Current: 5mA; Max Power Dissipation: 1.2W; Max Supply Voltage: 15V; Number Of Outputs: 1; Standoff Height: 0.64mm; Max Junction Temp: +125°C; Height: 1.8mm; Package: AMS1117; Device Class L2: Power Management ICs; ComponentLink2Description: Datasheet; ComponentLink2URL: http://www.advanced-monolithic.com/pdf/ds1117.pdf; Category: IC; RoHS: TRUE; Automotive: No; Device Class L1: Integrated Circuits (ICs); Output Current: 1A; Device Class L3: Voltage Regulators - Linear; Temperature: -40°C to +125°C; Output Voltage: 3.3V; Manufacturer Part Number: AMS1117-3.3; Temperature Range Low: -40°C; Octopart: https://octopart.com/ams1117-3.3-advanced+monolithic+systems-25899300; Lead Free: Yes; Ipc Land Pattern Name: SOT229P700X180-4; Temperature Range High: +125°C

## Nets that join several sheets
3,3V: uC (19 pins), power (D202.2 LD201.1 Q202.3 Q205.3)
3,3V_STLINK: uC (P300.7 P300.8 TP303.1), power (Q201.3)
5V_STLINK: uC (P300.9 P300.10 TP304.1), power (Q203.3)
GND: uC (57 pins), power (21 pins)